# EAGLE schematic shield (EAGLE 5.11)
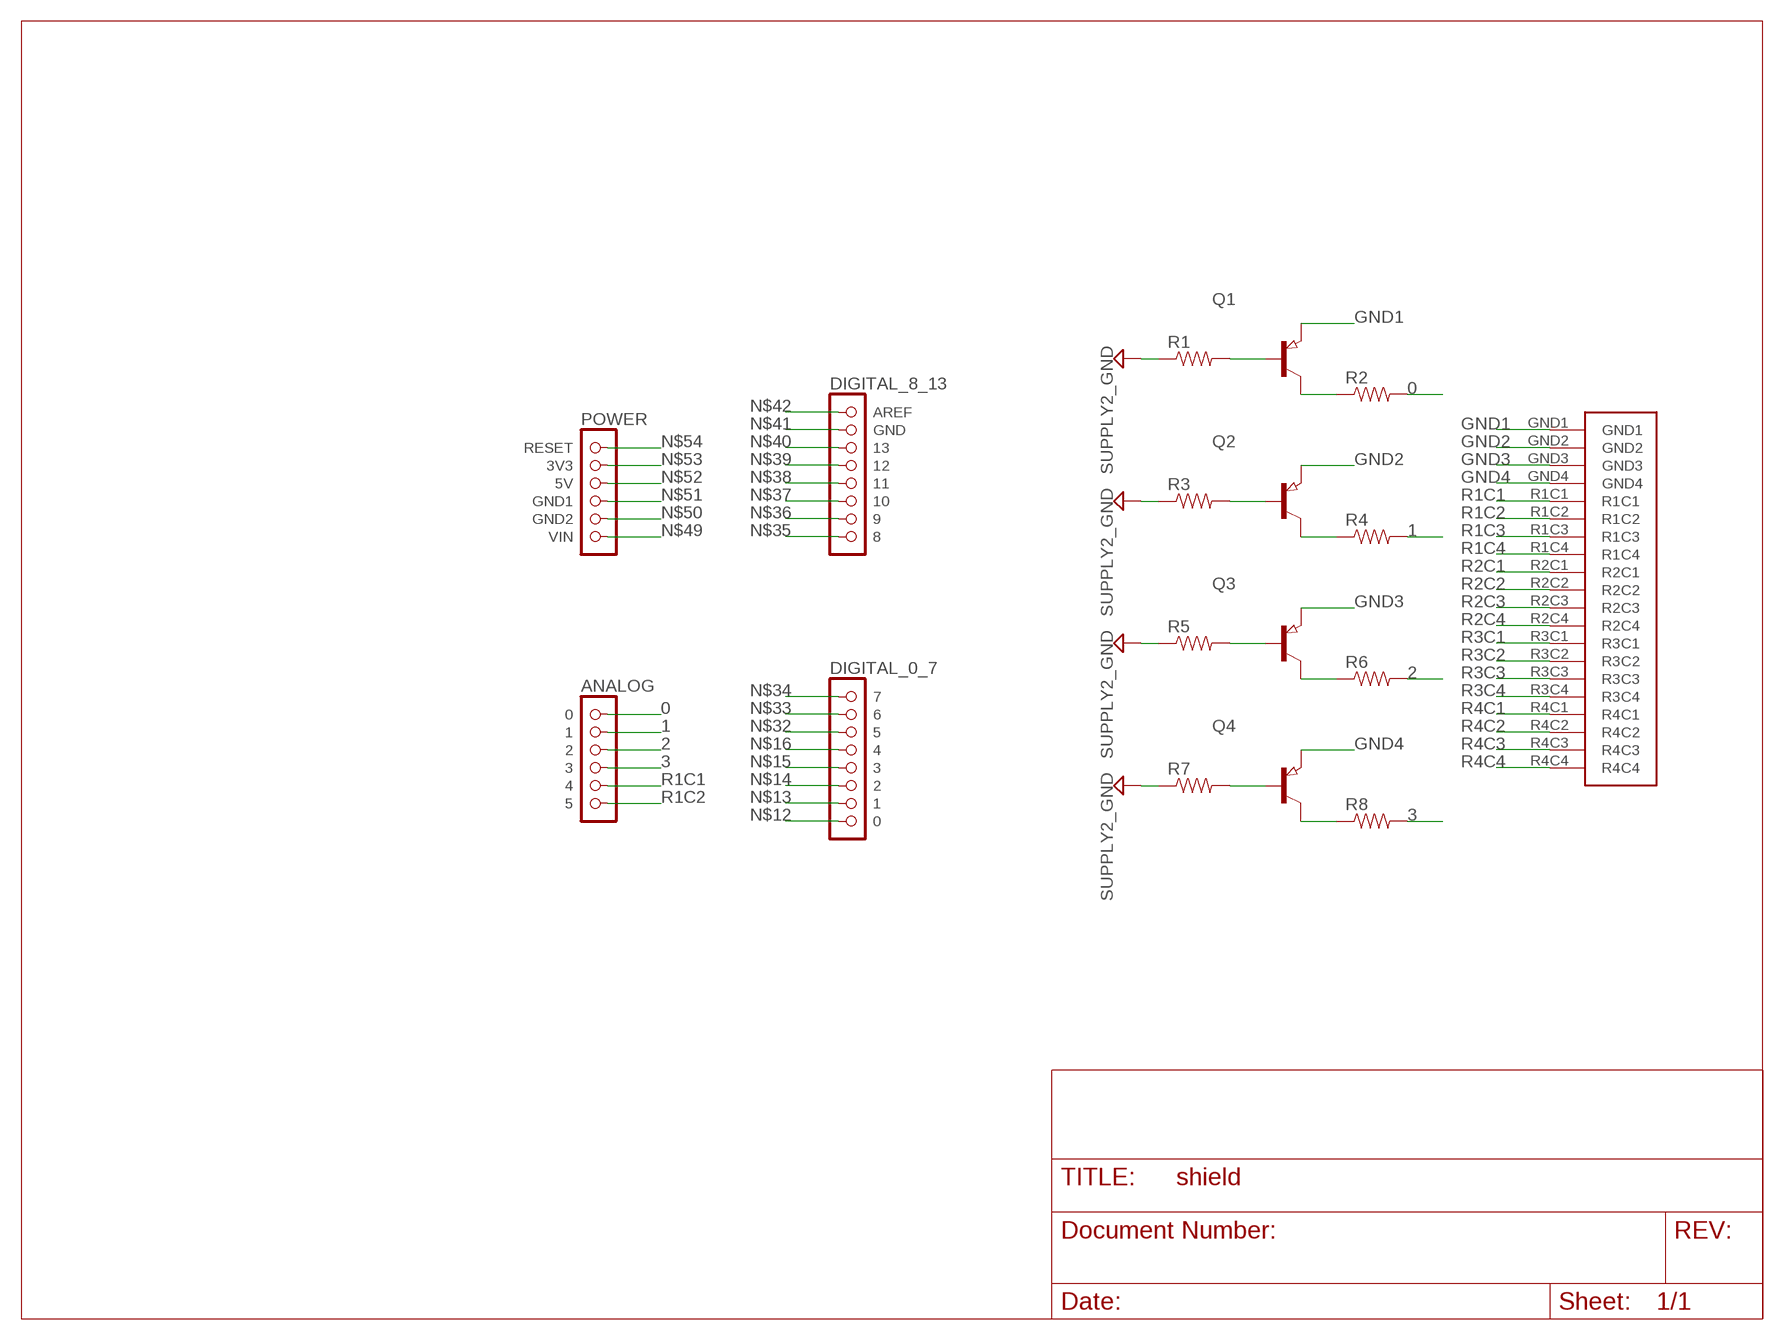
[diagram p0: schematic, sheet 1]

## Parts
Q1  PNP-TRANSISTOR_SOT89  [SOT89]
Q2  PNP-TRANSISTOR_SOT89  [SOT89]
Q3  PNP-TRANSISTOR_SOT89  [SOT89]
Q4  PNP-TRANSISTOR_SOT89  [SOT89]
R1  SPARKFUN_RESISTOR  [SPARKFUN_0805]
R2  SPARKFUN_RESISTOR  [SPARKFUN_0805]
R3  SPARKFUN_RESISTOR  [SPARKFUN_0805]
R4  SPARKFUN_RESISTOR  [SPARKFUN_0805]
R5  SPARKFUN_RESISTOR  [SPARKFUN_0805]
R6  SPARKFUN_RESISTOR  [SPARKFUN_0805]
R7  SPARKFUN_RESISTOR  [SPARKFUN_0805]
R8  SPARKFUN_RESISTOR  [SPARKFUN_0805]
U$1  POWER  [1X06]
U$2  ANALOG  [1X06]
U$3  DIGITAL_0_7  [1X08]
U$4  DIGITAL_8_13  [1X08]
U$5  4X4_LEDGRID  [LEDARRAY]

## Nets
0: R2.2 U$2.1
1: R4.2 U$2.2
2: R6.2 U$2.3
3: R8.2 U$2.4
GND: R1.1 R3.1 R5.1 R7.1 ; supply symbol labelled SUPPLY2_GND
GND1: Q1.3(E) U$5.GND1
GND2: Q2.3(E) U$5.GND2
GND3: Q3.3(E) U$5.GND3
GND4: Q4.3(E) U$5.GND4
N$1: Q1.1(B) R1.2
N$2: Q1.2(C) R2.1
N$3: Q2.1(B) R3.2
N$4: Q2.2(C) R4.1
N$5: Q3.1(B) R5.2
N$6: Q4.1(B) R7.2
N$7: Q4.2(C) R8.1
N$8: Q3.2(C) R6.1
N$12: U$3.8
N$13: U$3.7
N$14: U$3.6
N$15: U$3.5
N$16: U$3.4
N$32: U$3.3
N$33: U$3.2
N$34: U$3.1
N$35: U$4.8
N$36: U$4.7
N$37: U$4.6
N$38: U$4.5
N$39: U$4.4
N$40: U$4.3
N$41: U$4.2(GND)
N$42: U$4.1(AREF)
N$49: U$1.6(VIN)
N$50: U$1.5(GND2)
N$51: U$1.4(GND1)
N$52: U$1.3(5V)
N$53: U$1.2(3V3)
N$54: U$1.1(RESET)
R1C1: U$2.5 U$5.R1C1
R1C2: U$2.6 U$5.R1C2
R1C3: U$5.R1C3
R1C4: U$5.R1C4
R2C1: U$5.R2C1
R2C2: U$5.R2C2
R2C3: U$5.R2C3
R2C4: U$5.R2C4
R3C1: U$5.R3C1
R3C2: U$5.R3C2
R3C3: U$5.R3C3
R3C4: U$5.R3C4
R4C1: U$5.R4C1
R4C2: U$5.R4C2
R4C3: U$5.R4C3
R4C4: U$5.R4C4

## Library data of the parts
Q1-Q4 = semicon-smd-ipc:PNP-TRANSISTOR_: PNP TRANSISTOR
R1-R8 = NSL:SPARKFUN_RESISTOR: Resistor Basic schematic elements and footprints for 0603, 1206, and PTH 1/10th watt (small) resistors.
U$1 = arduino:POWER
U$2 = arduino:ANALOG
U$3 = arduino:DIGITAL_0_7
U$4 = arduino:DIGITAL_8_13
U$5 = NSL:4X4_LEDGRID